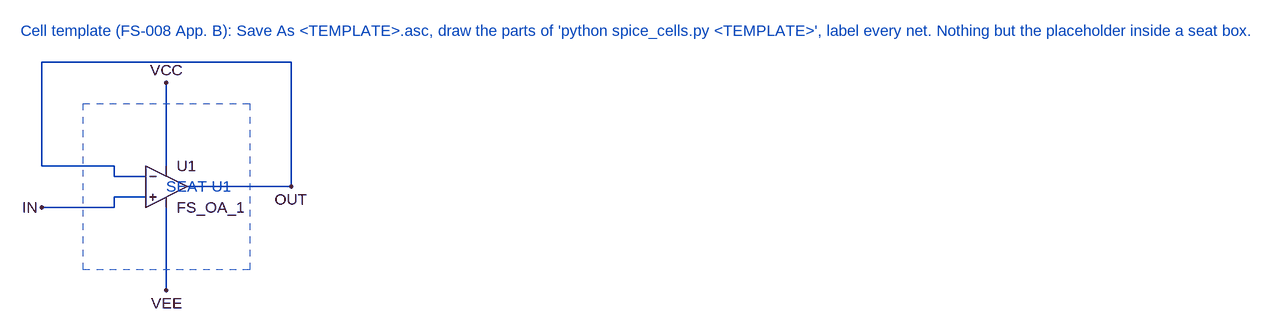
[diagram p0: schematic _cell_template.asc]
_cell_template.asc, the LTspice schematic file:
Version 4
SHEET 1 880 680
WIRE 224 240 176 240
WIRE 176 240 176 224
WIRE 176 224 128 224
WIRE 224 272 176 272
WIRE 176 272 176 288
WIRE 176 288 128 288
WIRE 288 256 384 256
WIRE 256 224 256 128
WIRE 256 288 256 384
WIRE 128 288 64 288
WIRE 128 224 64 224
WIRE 64 224 64 64
WIRE 64 64 448 64
WIRE 448 64 448 256
WIRE 384 256 448 256
WIRE 256 128 256 96
WIRE 256 384 256 416
FLAG 64 288 IN
FLAG 448 256 OUT
FLAG 256 96 VCC
FLAG 256 416 VEE
SYMBOL Opamps\\opamp2 256 192 R0
SYMATTR InstName U1
SYMATTR Value FS_OA_1
TEXT 256 256 Left 2 ;SEAT U1
TEXT 32 16 Left 2 ;Cell template (FS-008 App. B): Save As <TEMPLATE>.asc, draw the parts of 'python spice_cells.py <TEMPLATE>', label every net. Nothing but the placeholder inside a seat box.
RECTANGLE Normal 128 128 384 384 2

The netlist it stands for:
* _cell_template.asc
XU1 IN OUT VCC VEE OUT FS_OA_1  ; pins In+ In- V+ V- OUT
* SEAT U1
* Cell template (FS-008 App. B): Save As <TEMPLATE>.asc, draw the parts of 'python spice_cells.py <TEMPLATE>', label every net. Nothing but the placeholder inside a seat box.
.backanno
.end